# Altium schematic sheet Pressure Sensor.SchDoc
size A; SheetNumber: 1; SheetTotal: 6
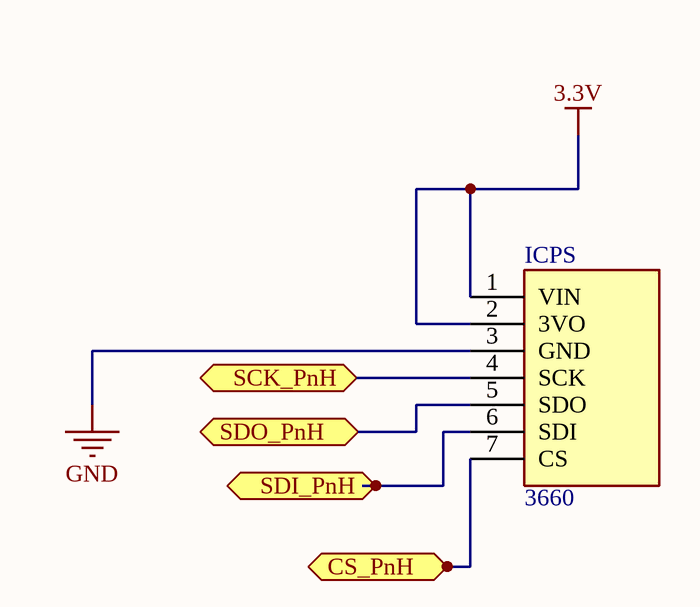
[diagram p0: Pressure Sensor.SchDoc]

## Parts
ICPS  3660  [3660]

## Ports
CS_PnH (bidir), SCK_PnH (bidir), SDI_PnH (bidir), SDO_PnH (bidir)

## Nets
3.3V: ICPS.1(VIN) ICPS.2(3VO)
GND: ICPS.3(GND)
CS_PnH: ICPS.7(CS) ; port CS_PnH
SCK_PnH: ICPS.4(SCK) ; port SCK_PnH
SDI_PnH: ICPS.6(SDI) ; port SDI_PnH
SDO_PnH: ICPS.5(SDO) ; port SDO_PnH

## Library data of the parts
ICPS = 3660: Integrated Circuit; Manufacturer_Name: Adafruit; Datasheet Link: https://cdn-learn.adafruit.com/downloads/pdf/adafruit-bme680-humidity-temperature-barometic-pressure-voc-gas.pdf; Height: 4mm; Manufacturer_Part_Number: 3660; Mouser Part Number: 485-3660; Mouser Price/Stock: https://www.mouser.co.uk/ProductDetail/Adafruit/3660?qs=W0yvOO0ixfFypXCClAyRMg%3D%3D; Arrow Part Number: 3660; Arrow Price/Stock: https://www.arrow.com/en/products/3660/adafruit-industries